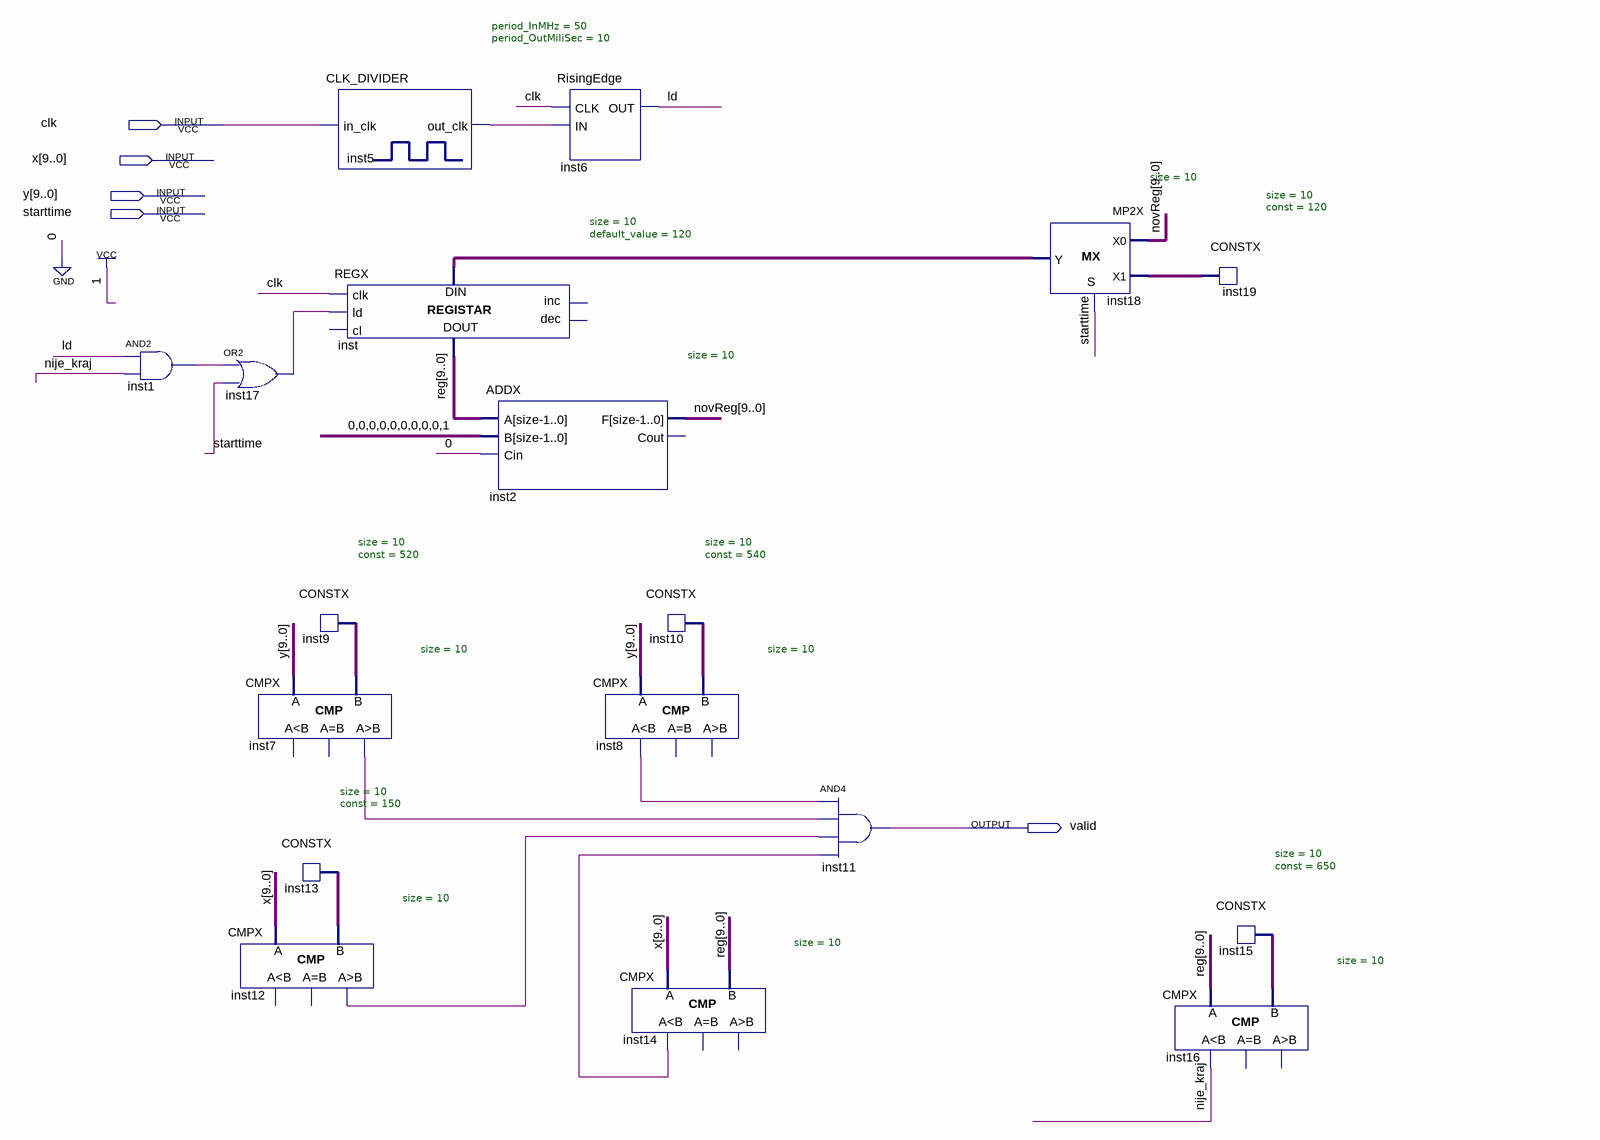
[diagram p0: schematic sheet]
// Quartus schematic loading.bdf as structural Verilog: 18 symbols, 5 pins
module loading (
  input  clk,
  input  [9:0] x,
  input  [9:0] y,
  input  starttime,
  output valid
);

  wire inst1_out, inst5_out_clk, inst7_gr, inst8_ls, inst12_gr, inst14_ls, inst17_out, ld, nije_kraj;
  wire [9:0] inst9_data, inst10_data, inst13_data, inst15_data, inst18_y, inst19_data, novReg, \reg ;

  and inst1 (inst1_out, ld, nije_kraj);
  or inst17 (inst17_out, inst1_out, starttime);
  CMPX #(.size(10)) inst12 (.A(x), .B(inst13_data), .gr(inst12_gr));  // open: ls, eq
  CONSTX #(.size(10), .\const (520)) inst9 (.data(inst9_data));
  CMPX #(.size(10)) inst7 (.A(y), .B(inst9_data), .gr(inst7_gr));  // open: ls, eq
  CONSTX #(.size(10), .\const (150)) inst13 (.data(inst13_data));
  CLK_DIVIDER #(.period_InMHz(50), .period_OutMiliSec(10)) inst5 (.in_clk(clk), .out_clk(inst5_out_clk));
  REGX #(.size(10), .default_value(120)) inst (
    .clk(clk), .ld(inst17_out), .data_in(inst18_y), .data_out(\reg ));  // open: cl, inc, dec
  ADDX #(.size(10)) inst2 (.A(\reg ), .B(10'b0000000001), .Cin(1'b0), .F(novReg));  // open: Cout
  RisingEdge inst6 (.CLK(clk), .IN(inst5_out_clk), .OUT(ld));
  CMPX #(.size(10)) inst8 (.A(y), .B(inst10_data), .ls(inst8_ls));  // open: eq, gr
  CONSTX #(.size(10), .\const (540)) inst10 (.data(inst10_data));
  CMPX #(.size(10)) inst14 (.A(x), .B(\reg ), .ls(inst14_ls));  // open: eq, gr
  and inst11 (valid, inst8_ls, inst7_gr, inst12_gr, inst14_ls);
  MP2X #(.size(10)) inst18 (.S(starttime), .X0(novReg), .X1(inst19_data), .Y(inst18_y));
  CMPX #(.size(10)) inst16 (.A(\reg ), .B(inst15_data), .ls(nije_kraj));  // open: eq, gr
  CONSTX #(.size(10), .\const (120)) inst19 (.data(inst19_data));
  CONSTX #(.size(10), .\const (650)) inst15 (.data(inst15_data));
endmodule
